# Altium schematic sheet 3_RTC.SchDoc: Apalis Evaluation Board 1.1
size A3; Organization: Toradex AG; Address1: Altsagenstrasse 5; Address2: Horw; Address3: 6048; Address4: Switzerland; DocumentNumber: 5; Revision: V1.1; SheetNumber: 5; SheetTotal: 32; PageSetup: Record=PageOptions|CenterHorizontal=True|CenterVertical=True|PrintScale=0.73|XCorrection=1.00|YCorrection=1.00|PrintKind=0|BorderSize=5000000|LeftOffset=0|BottomOffset=0|Orientation=2|PaperLength=1000|PaperWidth=1000|Scale=100|PaperSource=7|PrintQuality=-4|MediaType=1|DitherType=10|PaperKind=A4|PrintScaleMode=1
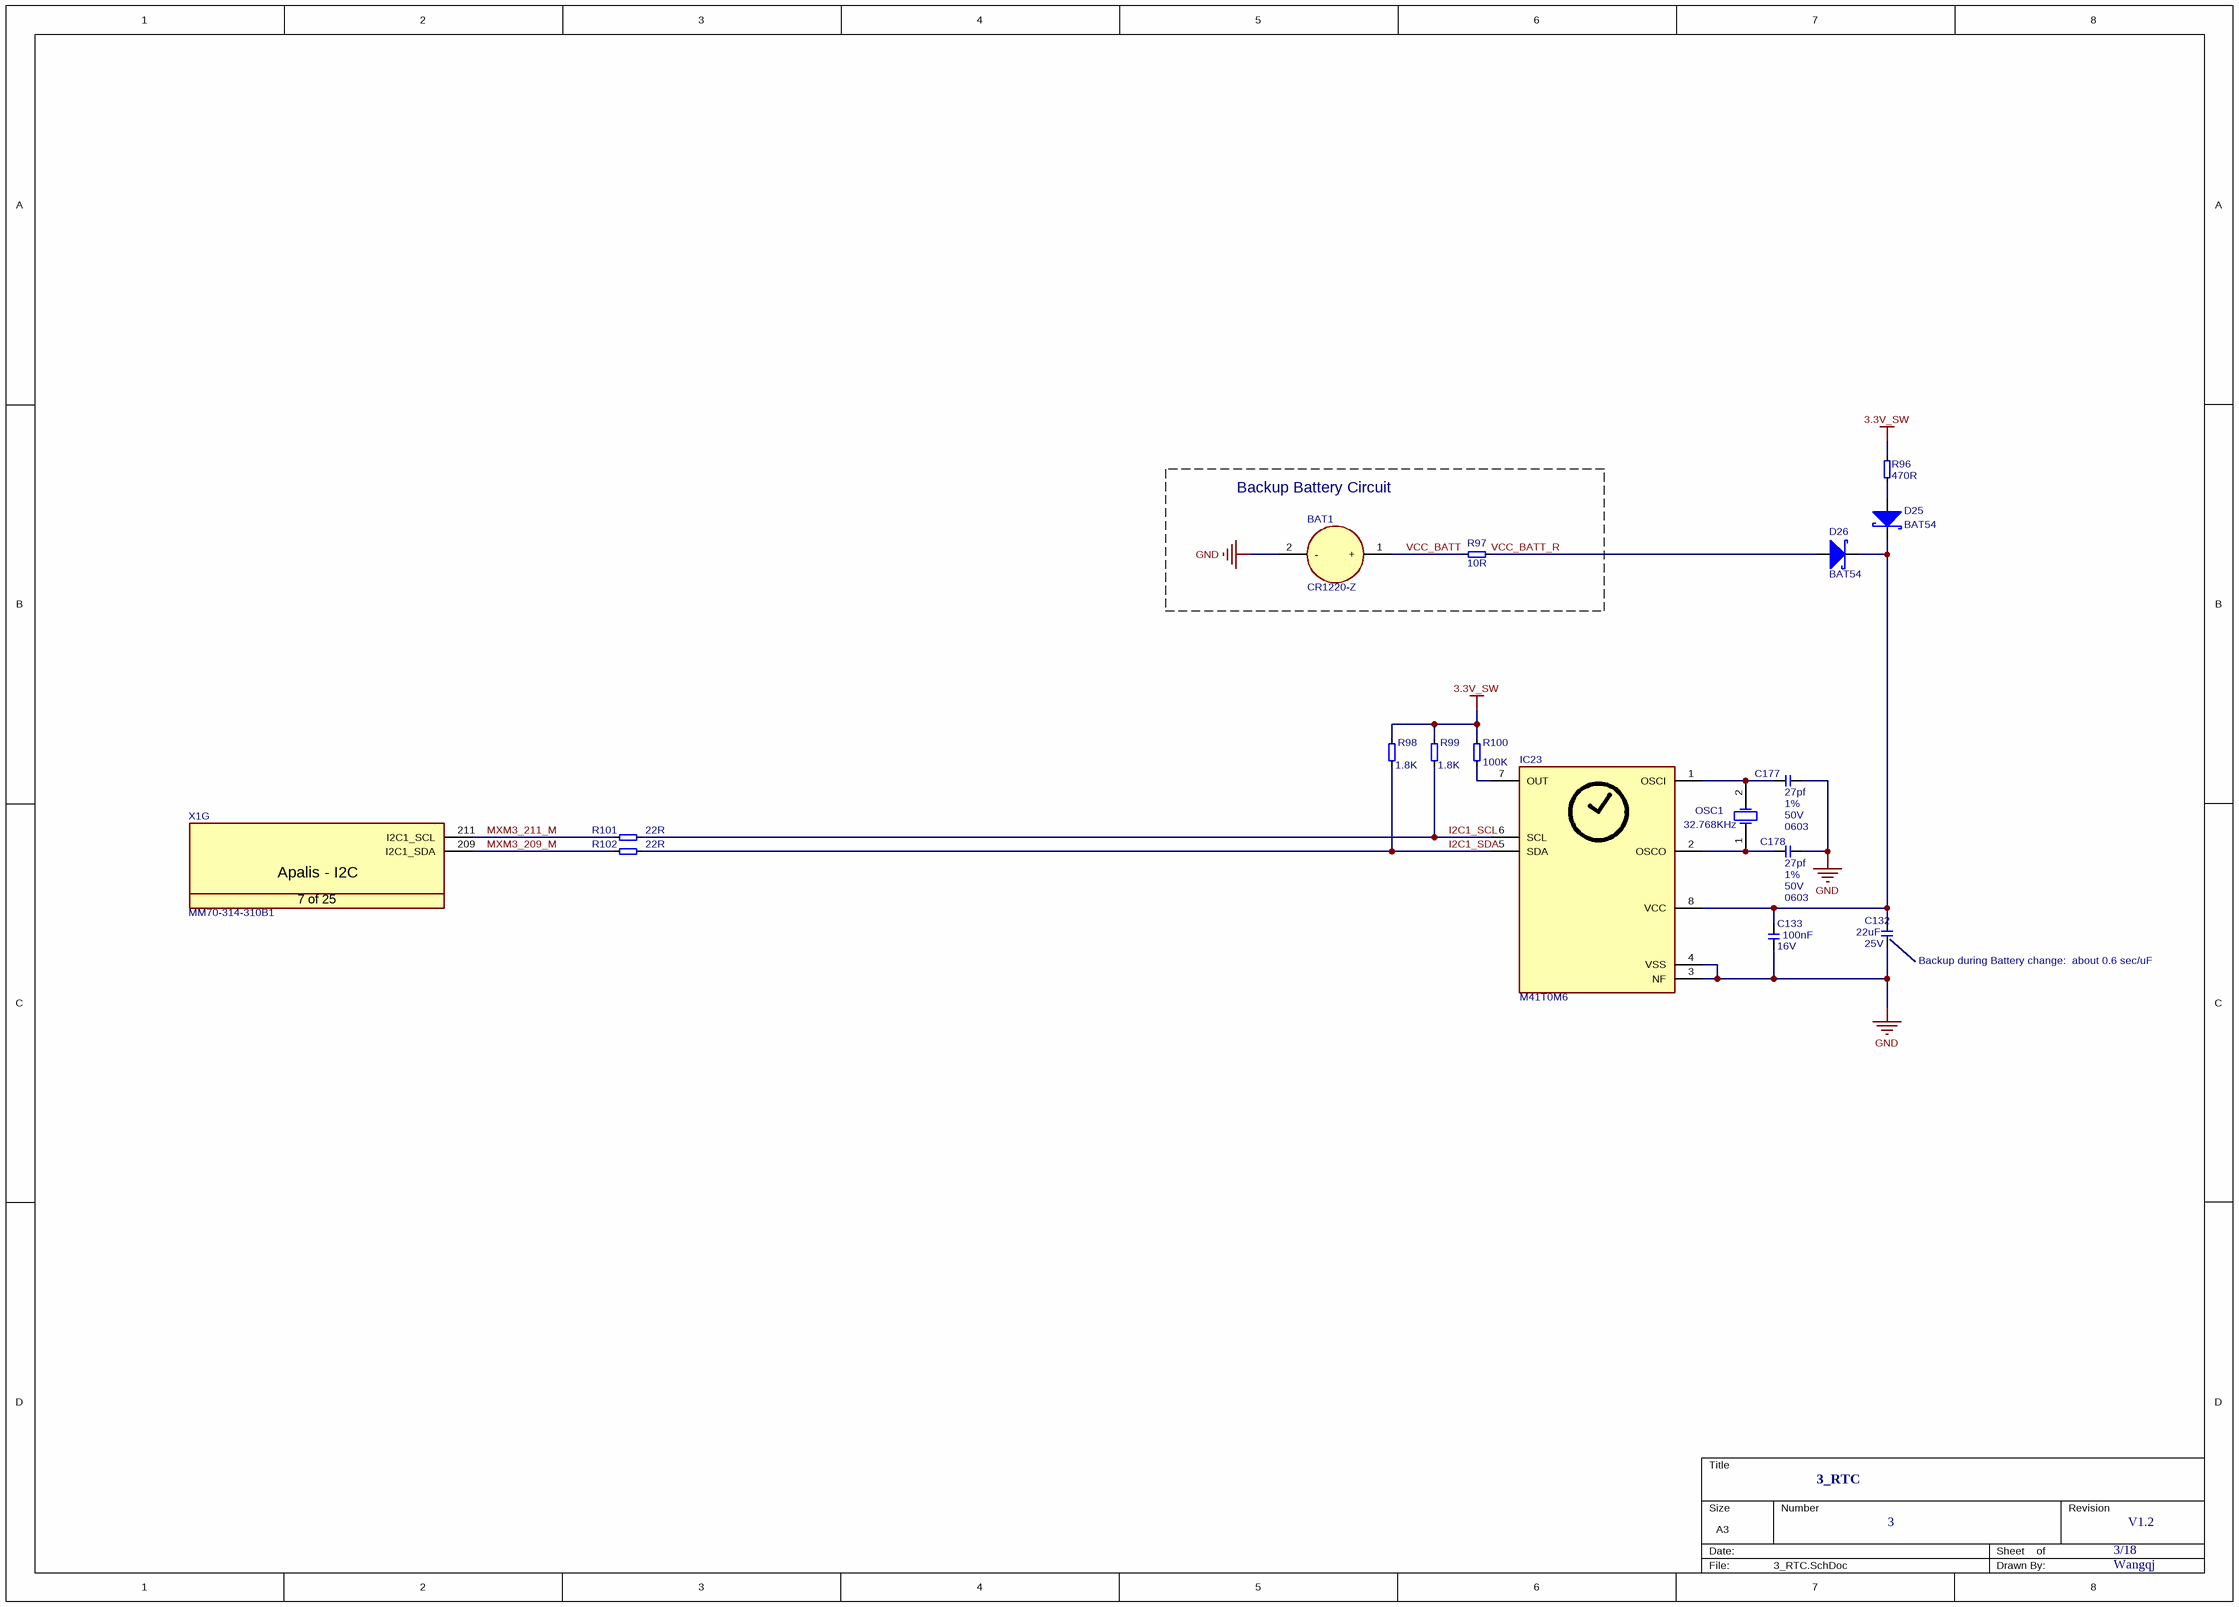
[diagram p0: 3_RTC.SchDoc]

## Parts
BAT1  CR1220-Z  [CR1220-Z]
C132  Rating: 25V  [CAPC3225X160N]  (hidden comment: 22uF)
C133  Rating: 16V  [T_CAPC0603X33N]  (hidden comment: 100nF)
C177  value 27pf  Tolerance: 1%  Rating: 50V  Footprint: 0603  [CAPC0603]  (hidden comment: 27pf-50V-1%-0603)
C178  value 27pf  Tolerance: 1%  Rating: 50V  Footprint: 0603  [CAPC0603]  (hidden comment: 0.1uf-50V-10%-0603)
D25  BAT54  [SOT95P230X110-3N]
D26  BAT54  [SOT95P230X110-3N]
IC23  M41T0M6  [SOIC127P600X173-8N]
OSC1  value 32.768KHz  [SMD-3215-2P]  (hidden comment: CC4V-T1A)
R96  470R  [T_RESC0603X30N]
R97  10R  [t_RESC0603X30N]
R98  1.8K  [T_RESC0603X30N]
R99  1.8K  [T_RESC0603X30N]
R100  100K  [t_RESC0603X30N]
R101  22R  [T_RESC0603X30N]
R102  22R  [T_RESC0603X30N]
X1  Manufacturer Part No.: MM70-314-310B1  [T_JAE_MM70-314-310B1]  (hidden comment: CON-JAE-MM70-314-310B1-314-0.5mm)  (part G of 25)

## Blocks framed on the sheet
Backup Battery Circuit: BAT1 R97

## Nets
3.3V_SW: R96.2 R98.2 R99.2 R100.2
GND: BAT1.2(-) C132.1 C133.1 C177.2 C178.2 IC23.3(NF) IC23.4(VSS)
I2C1_SCL: IC23.6(SCL) R99.1 R101.2
I2C1_SDA: IC23.5(SDA) R98.1 R102.2
MXM3_209_M: R102.1 X1.209(I2C1_SDA)
MXM3_211_M: R101.1 X1.211(I2C1_SCL)
VCC_BATT: BAT1.1(+) R97.1
VCC_BATT_R: D26.1 R97.2
NetC132_2: C132.2 C133.2 D25.3 D26.3 IC23.8(VCC)
NetC177_1: C177.1 IC23.1(OSCI) OSC1.2(OSC2)
NetC178_1: C178.1 IC23.2(OSCO) OSC1.1(OSC1)
NetD25_1: D25.1 R96.1
NetIC23_7: IC23.7(OUT) R100.1

## Notes on the sheet
- (near C132) Backup during Battery change:  about 0.6 sec/uF
- 3_RTC
- 3
- 3/18
- V1.2
- Wangqj
- Title
- Size:
- Date:
- A3
- Number:
- Time:
- Revision:
- Sheet
- of
- File:
- (in symbol CON-JAE-MM70-314-310B1-314-0.5mm, part G) Apalis - I2C; 7 of 25

## Library data of the parts
BAT1 = BAT-Renata-HU2032-LF: CR1220 Battery Holder; Manufacturer Name: Renata; Manufacturer Part No.: CR1220-Z
C132 = C-X5R-22uF-25V-20%-1210: Capacitor Ceramic X5R 22uF 25V 20% 1210; Tolerance: 20%; Type: X5R; Value: 22uF
C133 = C-X7R-100nF-16V-10%-0603: Capacitor Ceramic X7R 100nF 16V 10% 0603; Tolerance: 10%; Type: X7R; Value: 100nF
C177 C178 = C-Ceramic: 33pf-50V-5%-0603; Type: X7R
D25 D26 = D-Philips-BAT54-Schottky: BAT54 Schottky Diode; Manufacturer Name: Philips; Manufacturer Part No.: BAT54
IC23 = IC-ST-M41T0M6: RTC M41T0M6; Manufacturer Name: ST; Manufacturer Part No.: M41T0M6
OSC1 = OSC-MC-CC4V-T1A-32.768KHz-30ppm-5x1.9mm: Quartz 32.768kHz; Manufacturer Name: Micro Crystal; Tolerance: 30ppm; Manufacturer Part No.: CC4V-T1A
R96 = R-470R-63mW-5%-0603: Resistor 470 ohm 63mW 5% 0603; Rating: 63mW; Tolerance: 5%; Value: 470R
R97 = R-10R-63mW-5%-0603: Resistor 10 ohm 63mW 5% 0603; Rating: 63mW; Tolerance: 5%; Value: 10R
R98 R99 = R-1.8KR-63mW-5%-0603: Resistor 1.8 Kohm 63mW 5% 0603; Value: 1.8KR; Rating: 63mW; Tolerance: 5%
R100 = R-100KR-63mW-5%-0603: Resistor 100 Kohm 63mW 5% 0603; Value: 100KR; Rating: 63mW; Tolerance: 5%
R101 R102 = R-22R-63mW-5%-0402: Resistor 22 ohm 63mW 5% 0603; Rating: 63mW; Tolerance: 5%; Value: 22R
X1 = CON-JAE-MM70-314-310B1-314-0.5mm: MXM3 Connector; Manufacturer Name: JAE; No. of ways: 314